# Altium schematic sheet Thermostat_8CH.SchDoc: Thermostat 8CH v1.1
size 420 x 297 mm; Author: G.Kasprowicz; CompanyName: WUT ISE; DrawnBy: G.Kasprowicz; Organization: WUT ISE; Address1: PW ISE; Address2: Nowowiejska 15/19 00-665 Warsaw; Address3: gkasprow@gmail.com; DocumentNumber: 1; Revision: 2; SheetNumber: 1; SheetTotal: 9; ModifiedBy: -; CheckedDate: -; Title2: TOP; DivGrp: WUT ISE; Designer: G.Kasprowicz; ModifiedDate: -; ProjectName: Sensor Box
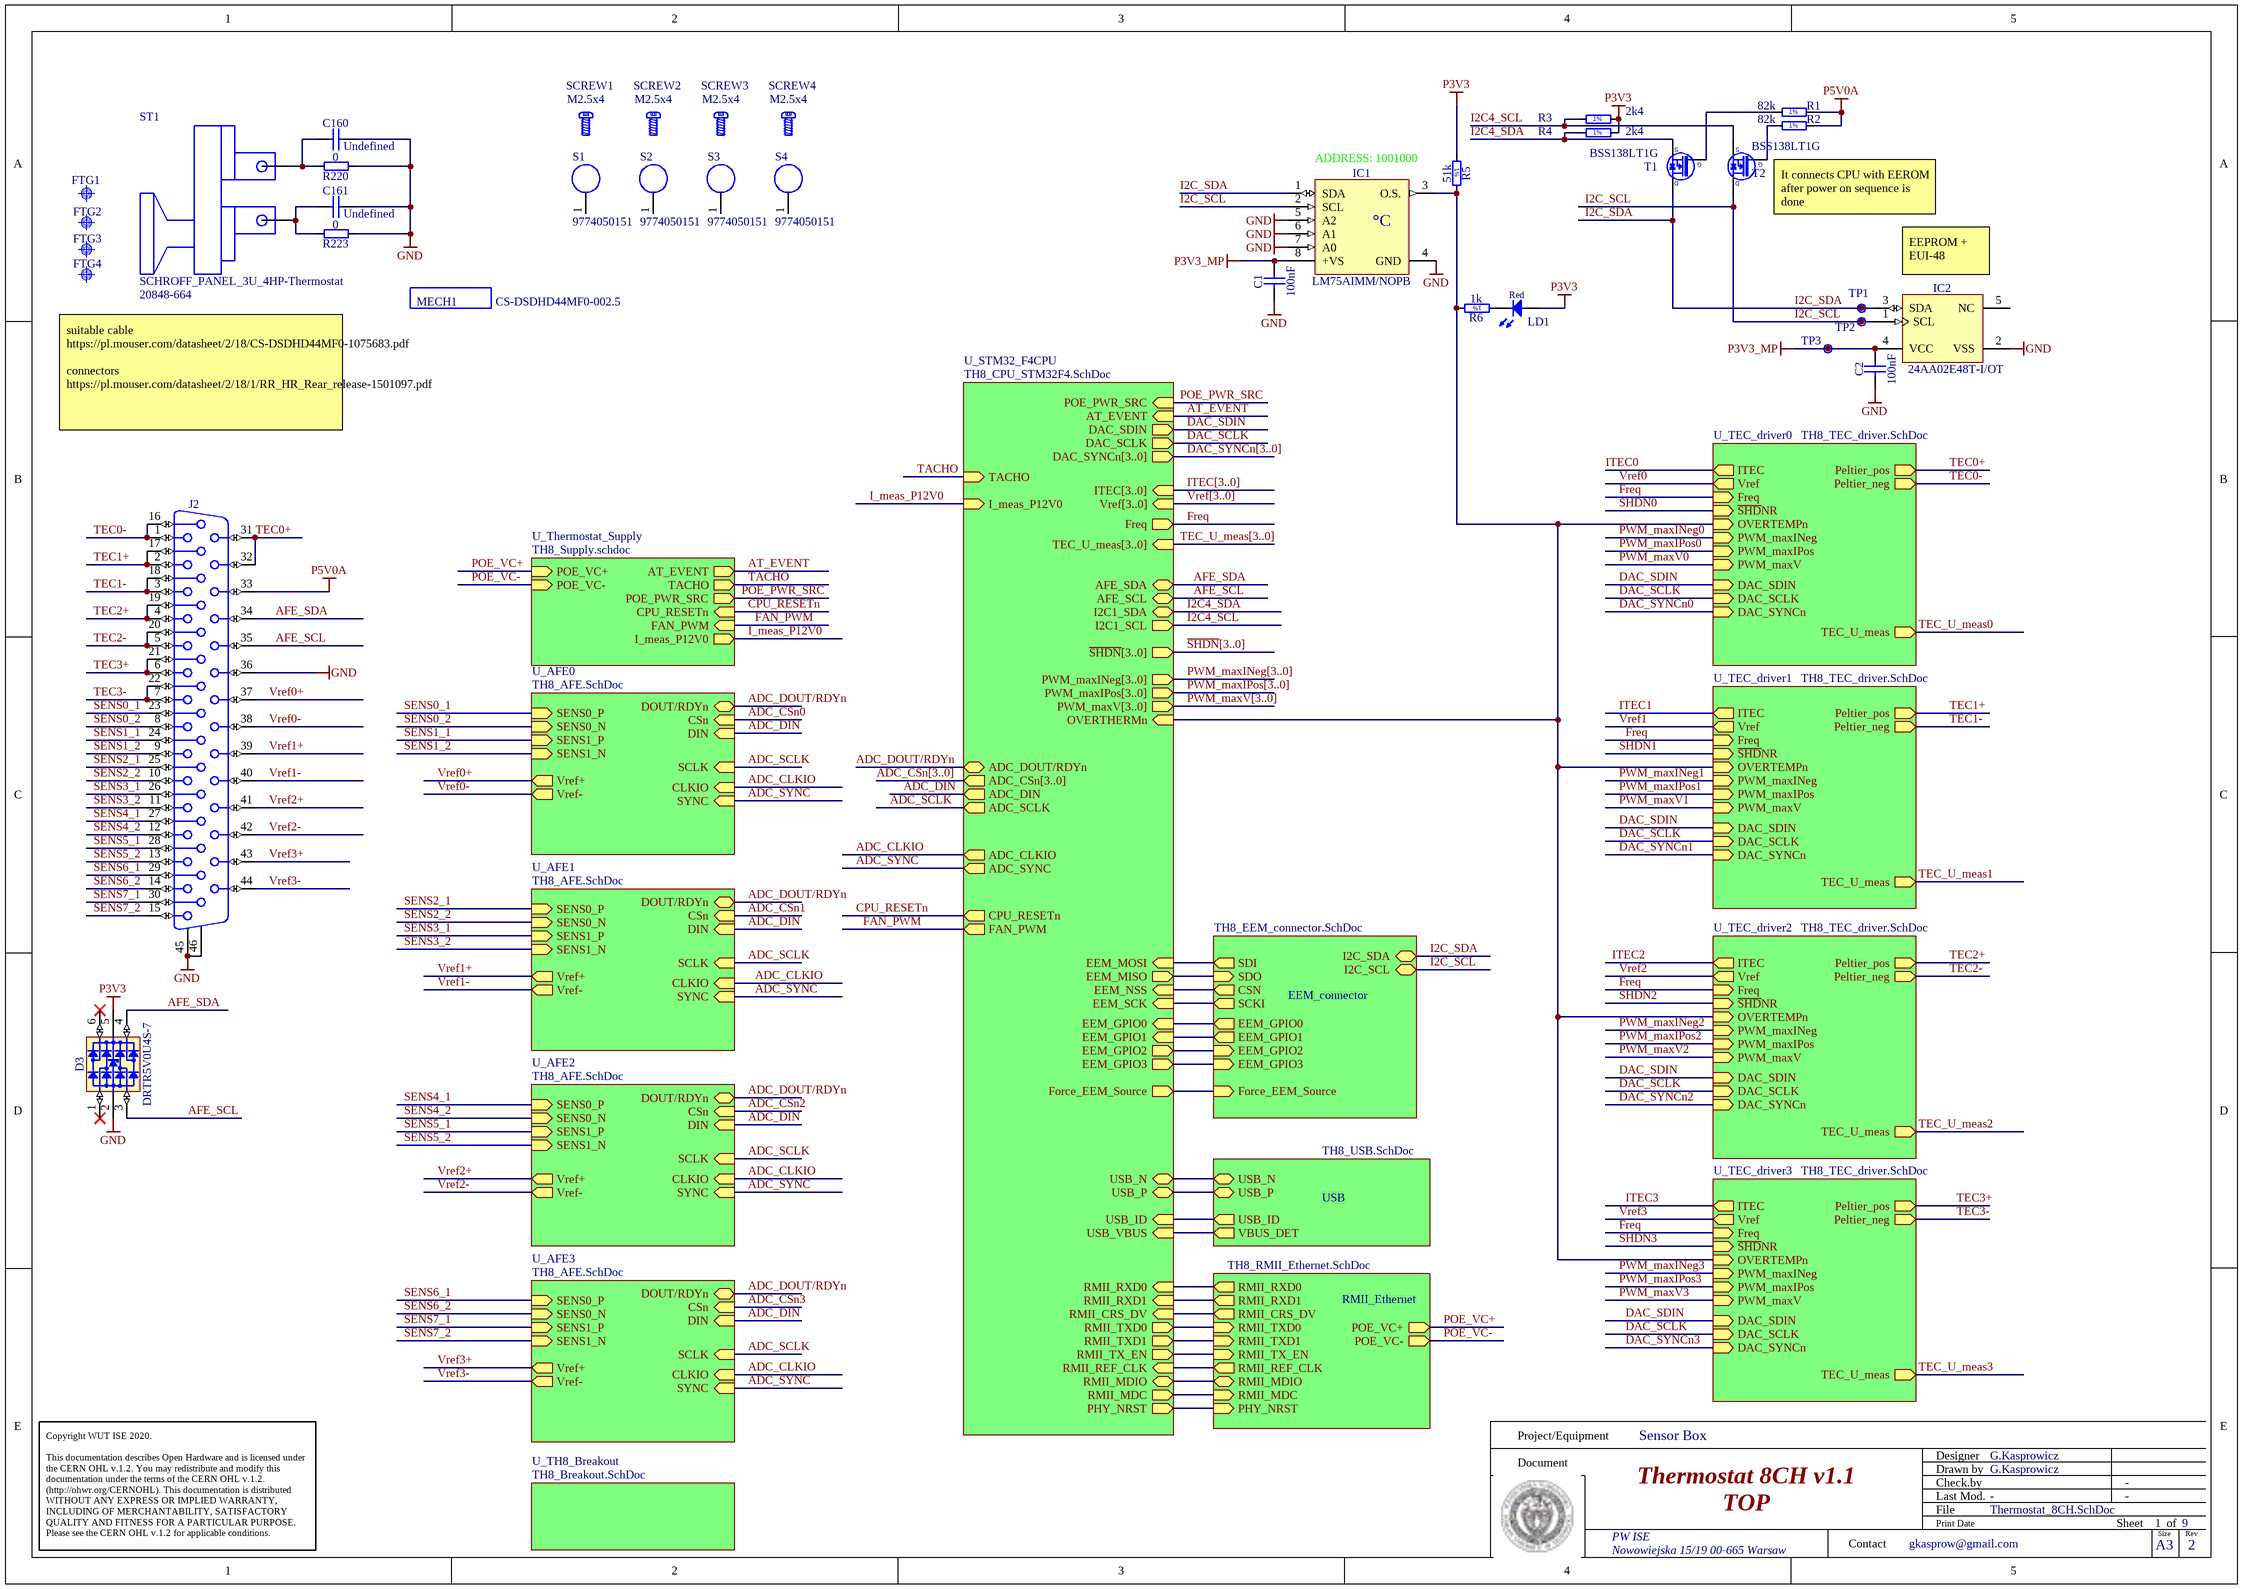
[diagram p0: Thermostat_8CH.SchDoc]

## Parts
C1  100nF  [CAPC1005X55N]
C2  100nF  [CAPC1005X55N]
C160  Undefined  [CAPC2012X135N]
C161  Undefined  [CAPC2012X135N]
D3  DRTR5V0U4S-7  [SOT65P210X110-6N]
FTG1  Use only in PCB  [FIDUCIAL_TOP_S100-200]  (value not drawn)  (no BOM)
FTG2  Use only in PCB  [FIDUCIAL_TOP_S100-200]  (value not drawn)  (no BOM)
FTG3  Use only in PCB  [FIDUCIAL_TOP_S100-200]  (value not drawn)  (no BOM)
FTG4  Use only in PCB  [FIDUCIAL_TOP_S100-200]  (value not drawn)  (no BOM)
IC1  LM75AIMM/NOPB  [SOP65P490X109-8N]
IC2  24AA02E48T-I/OT  [SOT95P280X145-5N]
J2  D-Sub  [AMPHENOL_ICD44S13E6GX00LF]  (value not drawn)
LD1  Red  [LED_KINGBRIGHT_KPH-1608SURCK]
MECH1  CS-DSDHD44MF0-002.5  (mechanical)
R1  82k  [RESC1608X55N]
R2  82k  [RESC1608X55N]
R3  2k4  [RESC1005X40N]
R4  2k4  [RESC1005X40N]
R5  51k  [RESC1005X40N]
R6  1k  [RESC1005X40N]
R220  0  [RESC1608X55N]
R223  0  [RESC1608X55N]
S1  9774050151  [9774050151]
S2  9774050151  [9774050151]
S3  9774050151  [9774050151]
S4  9774050151  [9774050151]
SCREW1  M2.5x4  [BOSSARD_BN5687-3061587_v]
SCREW2  M2.5x4  [BOSSARD_BN5687-3061587_v]
SCREW3  M2.5x4  [BOSSARD_BN5687-3061587_v]
SCREW4  M2.5x4  [BOSSARD_BN5687-3061587_v]
ST1  SCHROFF_PANEL_3U_4HP-Thermostat  Manufacturer Part Number 2: 20848-664  [SCHROFF_PANEL_3HP_4U - Thermostat]
T1  BSS138LT1G  [SOT95P240X110-3N]
T2  BSS138LT1G  [SOT95P240X110-3N]
TP1  Test Point  [TPS127]  (value not drawn)
TP2  Test Point  [TPS127]  (value not drawn)
TP3  Test Point  [TPS127]  (value not drawn)

## Sub-sheets
EEM_connector = TH8_EEM_connector.SchDoc: I2C_SDA (bidir), I2C_SCL (bidir), EEM_GPIO0 (out), EEM_GPIO1 (out), EEM_GPIO2 (in), EEM_GPIO3 (in), SCKI (out), SDI (out), CSN (out), SDO (in), Force_EEM_Source (in)
RMII_Ethernet = TH8_RMII_Ethernet.SchDoc: RMII_TXD0 (in), RMII_TX_EN (in), RMII_RXD0 (out), RMII_REF_CLK (out), RMII_CRS_DV (out), RMII_MDC (in), RMII_MDIO (bidir), PHY_NRST (in), RMII_TXD1 (in), RMII_RXD1 (out), POE_VC+ (out), POE_VC- (out)
U_AFE0 = TH8_AFE.SchDoc: SCLK (in), DOUT/RDYn (bidir), SENS1_P (in), SENS1_N (in), SENS0_N (in), SENS0_P (in), CSn (in), DIN (in), CLKIO (in), SYNC (in), Vref- (out), Vref+ (out)
U_AFE1 = TH8_AFE.SchDoc: SCLK (in), DOUT/RDYn (bidir), SENS1_P (in), SENS1_N (in), SENS0_N (in), SENS0_P (in), CSn (in), DIN (in), CLKIO (in), SYNC (in), Vref- (out), Vref+ (out)
U_AFE2 = TH8_AFE.SchDoc: SCLK (in), DOUT/RDYn (bidir), SENS1_P (in), SENS1_N (in), SENS0_N (in), SENS0_P (in), CSn (in), DIN (in), CLKIO (in), SYNC (in), Vref- (out), Vref+ (out)
U_AFE3 = TH8_AFE.SchDoc: SCLK (in), DOUT/RDYn (bidir), SENS1_P (in), SENS1_N (in), SENS0_N (in), SENS0_P (in), CSn (in), DIN (in), CLKIO (in), SYNC (in), Vref- (out), Vref+ (out)
U_STM32_F4CPU = TH8_CPU_STM32F4.SchDoc: OVERTHERMn (in), ITEC[3..0] (in), Vref[3..0] (in), Freq (out), ~{SHDN}[3..0] (out), PWM_maxINeg[3..0] (out), PWM_maxIPos[3..0] (out), PWM_maxV[3..0] (out), ADC_SCLK (out), ADC_DOUT/RDYn (bidir), ADC_CSn[3..0] (out), ADC_DIN (out), DAC_SDIN (out), DAC_SCLK (out), DAC_SYNCn[3..0] (out), AT_EVENT (in), ADC_CLKIO (out), ADC_SYNC (out), TEC_U_meas[3..0] (in), CPU_RESETn (out), I2C1_SDA (bidir), I2C1_SCL (out), TACHO (in), POE_PWR_SRC (in), RMII_RXD0 (in), RMII_TXD0 (out), RMII_RXD1 (in), RMII_MDC (out), RMII_TXD1 (out), RMII_TX_EN (out), RMII_CRS_DV (in), RMII_REF_CLK (in), RMII_MDIO (bidir), PHY_NRST (out), USB_ID (in), USB_N (bidir), USB_P (bidir), USB_VBUS (in), EEM_MOSI (in), EEM_MISO (out), EEM_NSS (in), EEM_SCK (in), EEM_GPIO0 (in), EEM_GPIO1 (in), EEM_GPIO2 (out), EEM_GPIO3 (out), Force_EEM_Source (out), AFE_SDA (bidir), AFE_SCL (bidir), FAN_PWM (out), I_meas_P12V0 (in)
U_TEC_driver0 = TH8_TEC_driver.SchDoc: Peltier_pos (out), Peltier_neg (out), Freq (in), ~{SHD}NR (in), ITEC (out), Vref (out), PWM_maxINeg (in), PWM_maxIPos (in), PWM_maxV (in), DAC_SDIN (in), DAC_SYNCn (in), DAC_SCLK (in), TEC_U_meas (out), OVERTEMPn (in)
U_TEC_driver1 = TH8_TEC_driver.SchDoc: Peltier_pos (out), Peltier_neg (out), Freq (in), ~{SHD}NR (in), ITEC (out), Vref (out), PWM_maxINeg (in), PWM_maxIPos (in), PWM_maxV (in), DAC_SDIN (in), DAC_SYNCn (in), DAC_SCLK (in), TEC_U_meas (out), OVERTEMPn (in)
U_TEC_driver2 = TH8_TEC_driver.SchDoc: Peltier_pos (out), Peltier_neg (out), Freq (in), ~{SHD}NR (in), ITEC (out), Vref (out), PWM_maxINeg (in), PWM_maxIPos (in), PWM_maxV (in), DAC_SDIN (in), DAC_SYNCn (in), DAC_SCLK (in), TEC_U_meas (out), OVERTEMPn (in)
U_TEC_driver3 = TH8_TEC_driver.SchDoc: Peltier_pos (out), Peltier_neg (out), Freq (in), ~{SHD}NR (in), ITEC (out), Vref (out), PWM_maxINeg (in), PWM_maxIPos (in), PWM_maxV (in), DAC_SDIN (in), DAC_SYNCn (in), DAC_SCLK (in), TEC_U_meas (out), OVERTEMPn (in)
U_TH8_Breakout = TH8_Breakout.SchDoc: no entries
U_Thermostat_Supply = TH8_Supply.schdoc: POE_VC+ (in), POE_VC- (in), AT_EVENT (out), CPU_RESETn (in), TACHO (out), POE_PWR_SRC (out), FAN_PWM (in), I_meas_P12V0 (out)
USB = TH8_USB.SchDoc: VBUS_DET (out), USB_N (bidir), USB_P (bidir), USB_ID (out)

## Nets
GND: C1.1 C2.1 C160.2 C161.2 D3.2(GND) IC1.4(GND) IC1.5(A2) IC1.6(A1) IC1.7(A0) IC2.2(VSS) J2.36 J2.45 J2.46 R220.1 R223.1
P3V3: D3.5(VBUS) LD1.2(A) R3.2 R4.2 R5.1
P3V3_MP: C1.2 C2.2 IC1.8(+VS) IC2.4(VCC) TP3.1
P5V0A: J2.33 R1.2 R2.2
~{SHDN}0: sheet U_TEC_driver0/~{SHD}NR
~{SHDN}1: sheet U_TEC_driver1/~{SHD}NR
~{SHDN}2: sheet U_TEC_driver2/~{SHD}NR
~{SHDN}3: sheet U_TEC_driver3/~{SHD}NR
ADC_CLKIO: sheet U_STM32_F4CPU/ADC_CLKIO, sheet U_AFE0/CLKIO, sheet U_AFE1/CLKIO, sheet U_AFE2/CLKIO, sheet U_AFE3/CLKIO
ADC_CSn0: sheet U_AFE0/CSn
ADC_CSn1: sheet U_AFE1/CSn
ADC_CSn2: sheet U_AFE2/CSn
ADC_CSn3: sheet U_AFE3/CSn
ADC_DIN: sheet U_STM32_F4CPU/ADC_DIN, sheet U_AFE0/DIN, sheet U_AFE1/DIN, sheet U_AFE2/DIN, sheet U_AFE3/DIN
ADC_DOUT/RDYn: sheet U_STM32_F4CPU/ADC_DOUT/RDYn, sheet U_AFE0/DOUT/RDYn, sheet U_AFE1/DOUT/RDYn, sheet U_AFE2/DOUT/RDYn, sheet U_AFE3/DOUT/RDYn
ADC_SCLK: sheet U_STM32_F4CPU/ADC_SCLK, sheet U_AFE0/SCLK, sheet U_AFE1/SCLK, sheet U_AFE2/SCLK, sheet U_AFE3/SCLK
ADC_SYNC: sheet U_STM32_F4CPU/ADC_SYNC, sheet U_AFE0/SYNC, sheet U_AFE1/SYNC, sheet U_AFE2/SYNC, sheet U_AFE3/SYNC
AFE_SCL: D3.3(I/O2) J2.35 ; sheet U_STM32_F4CPU/AFE_SCL
AFE_SDA: D3.4(I/O3) J2.34 ; sheet U_STM32_F4CPU/AFE_SDA
AT_EVENT: sheet U_STM32_F4CPU/AT_EVENT, sheet U_Thermostat_Supply/AT_EVENT
CPU_RESETn: sheet U_STM32_F4CPU/CPU_RESETn, sheet U_Thermostat_Supply/CPU_RESETn
DAC_SCLK: sheet U_STM32_F4CPU/DAC_SCLK, sheet U_TEC_driver0/DAC_SCLK, sheet U_TEC_driver1/DAC_SCLK, sheet U_TEC_driver2/DAC_SCLK, sheet U_TEC_driver3/DAC_SCLK
DAC_SDIN: sheet U_STM32_F4CPU/DAC_SDIN, sheet U_TEC_driver0/DAC_SDIN, sheet U_TEC_driver1/DAC_SDIN, sheet U_TEC_driver2/DAC_SDIN, sheet U_TEC_driver3/DAC_SDIN
DAC_SYNCn0: sheet U_TEC_driver0/DAC_SYNCn
DAC_SYNCn1: sheet U_TEC_driver1/DAC_SYNCn
DAC_SYNCn2: sheet U_TEC_driver2/DAC_SYNCn
DAC_SYNCn3: sheet U_TEC_driver3/DAC_SYNCn
FAN_PWM: sheet U_STM32_F4CPU/FAN_PWM, sheet U_Thermostat_Supply/FAN_PWM
Freq: sheet U_STM32_F4CPU/Freq, sheet U_TEC_driver0/Freq, sheet U_TEC_driver1/Freq, sheet U_TEC_driver2/Freq, sheet U_TEC_driver3/Freq
I2C4_SCL: R3.1 T2.2(S) ; sheet U_STM32_F4CPU/I2C1_SCL
I2C4_SDA: R4.1 T1.2(S) ; sheet U_STM32_F4CPU/I2C1_SDA
I2C_SCL: IC1.2(SCL) IC2.1(SCL) T2.3(D) TP2.1 ; sheet EEM_connector/I2C_SCL
I2C_SDA: IC1.1(SDA) IC2.3(SDA) T1.3(D) TP1.1 ; sheet EEM_connector/I2C_SDA
I_meas_P12V0: sheet U_STM32_F4CPU/I_meas_P12V0, sheet U_Thermostat_Supply/I_meas_P12V0
ITEC0: sheet U_TEC_driver0/ITEC
ITEC1: sheet U_TEC_driver1/ITEC
ITEC2: sheet U_TEC_driver2/ITEC
ITEC3: sheet U_TEC_driver3/ITEC
POE_PWR_SRC: sheet U_STM32_F4CPU/POE_PWR_SRC, sheet U_Thermostat_Supply/POE_PWR_SRC
POE_VC+: sheet RMII_Ethernet/POE_VC+, sheet U_Thermostat_Supply/POE_VC+
POE_VC-: sheet RMII_Ethernet/POE_VC-, sheet U_Thermostat_Supply/POE_VC-
PWM_maxINeg0: sheet U_TEC_driver0/PWM_maxINeg
PWM_maxINeg1: sheet U_TEC_driver1/PWM_maxINeg
PWM_maxINeg2: sheet U_TEC_driver2/PWM_maxINeg
PWM_maxINeg3: sheet U_TEC_driver3/PWM_maxINeg
PWM_maxIPos0: sheet U_TEC_driver0/PWM_maxIPos
PWM_maxIPos1: sheet U_TEC_driver1/PWM_maxIPos
PWM_maxIPos2: sheet U_TEC_driver2/PWM_maxIPos
PWM_maxIPos3: sheet U_TEC_driver3/PWM_maxIPos
PWM_maxV0: sheet U_TEC_driver0/PWM_maxV
PWM_maxV1: sheet U_TEC_driver1/PWM_maxV
PWM_maxV2: sheet U_TEC_driver2/PWM_maxV
PWM_maxV3: sheet U_TEC_driver3/PWM_maxV
SENS0_1: J2.23 ; sheet U_AFE0/SENS0_P
SENS0_2: J2.8 ; sheet U_AFE0/SENS0_N
SENS1_1: J2.24 ; sheet U_AFE0/SENS1_P
SENS1_2: J2.9 ; sheet U_AFE0/SENS1_N
SENS2_1: J2.25 ; sheet U_AFE1/SENS0_P
SENS2_2: J2.10 ; sheet U_AFE1/SENS0_N
SENS3_1: J2.26 ; sheet U_AFE1/SENS1_P
SENS3_2: J2.11 ; sheet U_AFE1/SENS1_N
SENS4_1: J2.27 ; sheet U_AFE2/SENS0_P
SENS4_2: J2.12 ; sheet U_AFE2/SENS0_N
SENS5_1: J2.28 ; sheet U_AFE2/SENS1_P
SENS5_2: J2.13 ; sheet U_AFE2/SENS1_N
SENS6_1: J2.29 ; sheet U_AFE3/SENS0_P
SENS6_2: J2.14 ; sheet U_AFE3/SENS0_N
SENS7_1: J2.30 ; sheet U_AFE3/SENS1_P
SENS7_2: J2.15 ; sheet U_AFE3/SENS1_N
TACHO: sheet U_STM32_F4CPU/TACHO, sheet U_Thermostat_Supply/TACHO
TEC0+: J2.31 J2.32 ; sheet U_TEC_driver0/Peltier_pos
TEC0-: J2.1 J2.16 ; sheet U_TEC_driver0/Peltier_neg
TEC1+: J2.2 J2.17 ; sheet U_TEC_driver1/Peltier_pos
TEC1-: J2.3 J2.18 ; sheet U_TEC_driver1/Peltier_neg
TEC2+: J2.4 J2.19 ; sheet U_TEC_driver2/Peltier_pos
TEC2-: J2.5 J2.20 ; sheet U_TEC_driver2/Peltier_neg
TEC3+: J2.6 J2.21 ; sheet U_TEC_driver3/Peltier_pos
TEC3-: J2.7 J2.22 ; sheet U_TEC_driver3/Peltier_neg
TEC_U_meas0: sheet U_TEC_driver0/TEC_U_meas
TEC_U_meas1: sheet U_TEC_driver1/TEC_U_meas
TEC_U_meas2: sheet U_TEC_driver2/TEC_U_meas
TEC_U_meas3: sheet U_TEC_driver3/TEC_U_meas
Vref0: sheet U_TEC_driver0/Vref
Vref0+: J2.37 ; sheet U_AFE0/Vref+
Vref0-: J2.38 ; sheet U_AFE0/Vref-
Vref1: sheet U_TEC_driver1/Vref
Vref1+: J2.39 ; sheet U_AFE1/Vref+
Vref1-: J2.40 ; sheet U_AFE1/Vref-
Vref2: sheet U_TEC_driver2/Vref
Vref2+: J2.41 ; sheet U_AFE2/Vref+
Vref2-: J2.42 ; sheet U_AFE2/Vref-
Vref3: sheet U_TEC_driver3/Vref
Vref3+: J2.43 ; sheet U_AFE3/Vref+
Vref3-: J2.44 ; sheet U_AFE3/Vref-
NetC160_1: C160.1 R220.2 ST1.1
NetC161_1: C161.1 R223.2 ST1.0
NetIC1_3: IC1.3(O.S.) R5.2 R6.2 ; sheet U_STM32_F4CPU/OVERTHERMn, sheet U_TEC_driver0/OVERTEMPn, sheet U_TEC_driver1/OVERTEMPn, sheet U_TEC_driver2/OVERTEMPn, sheet U_TEC_driver3/OVERTEMPn
NetLD1_1: LD1.1(C) R6.1
NetR1_1: R1.1 T1.1(G)
NetR2_1: R2.1 T2.1(G)
(unnamed): sheet U_STM32_F4CPU/RMII_RXD0, sheet RMII_Ethernet/RMII_RXD0
(unnamed): sheet U_STM32_F4CPU/RMII_TXD0, sheet RMII_Ethernet/RMII_TXD0
(unnamed): sheet U_STM32_F4CPU/RMII_RXD1, sheet RMII_Ethernet/RMII_RXD1
(unnamed): sheet U_STM32_F4CPU/RMII_MDC, sheet RMII_Ethernet/RMII_MDC
(unnamed): sheet U_STM32_F4CPU/RMII_TXD1, sheet RMII_Ethernet/RMII_TXD1
(unnamed): sheet U_STM32_F4CPU/RMII_TX_EN, sheet RMII_Ethernet/RMII_TX_EN
(unnamed): sheet U_STM32_F4CPU/RMII_CRS_DV, sheet RMII_Ethernet/RMII_CRS_DV
(unnamed): sheet U_STM32_F4CPU/RMII_REF_CLK, sheet RMII_Ethernet/RMII_REF_CLK
(unnamed): sheet U_STM32_F4CPU/RMII_MDIO, sheet RMII_Ethernet/RMII_MDIO
(unnamed): sheet U_STM32_F4CPU/PHY_NRST, sheet RMII_Ethernet/PHY_NRST
(unnamed): sheet U_STM32_F4CPU/USB_ID, sheet USB/USB_ID
(unnamed): sheet U_STM32_F4CPU/USB_N, sheet USB/USB_N
(unnamed): sheet U_STM32_F4CPU/USB_P, sheet USB/USB_P
(unnamed): sheet U_STM32_F4CPU/USB_VBUS, sheet USB/VBUS_DET
(unnamed): sheet U_STM32_F4CPU/EEM_MOSI, sheet EEM_connector/SDI
(unnamed): sheet U_STM32_F4CPU/EEM_MISO, sheet EEM_connector/SDO
(unnamed): sheet U_STM32_F4CPU/EEM_NSS, sheet EEM_connector/CSN
(unnamed): sheet U_STM32_F4CPU/EEM_SCK, sheet EEM_connector/SCKI
(unnamed): sheet U_STM32_F4CPU/EEM_GPIO0, sheet EEM_connector/EEM_GPIO0
(unnamed): sheet U_STM32_F4CPU/EEM_GPIO1, sheet EEM_connector/EEM_GPIO1
(unnamed): sheet U_STM32_F4CPU/EEM_GPIO2, sheet EEM_connector/EEM_GPIO2
(unnamed): sheet U_STM32_F4CPU/EEM_GPIO3, sheet EEM_connector/EEM_GPIO3
(unnamed): sheet U_STM32_F4CPU/Force_EEM_Source, sheet EEM_connector/Force_EEM_Source

Not connected (* = marked no-connect by the designer): D3 1(I/O1)* 6(I/O4)*; IC2 5(NC); S1 1; S2 1; S3 1; S4 1

## Buses and harness runs
bus ADC_CSn[3..0] = sheet U_STM32_F4CPU/ADC_CSn[3..0]
bus DAC_SYNCn[3..0] = sheet U_STM32_F4CPU/DAC_SYNCn[3..0]
bus ITEC[3..0] = sheet U_STM32_F4CPU/ITEC[3..0]
bus PWM_maxINeg[3..0] = sheet U_STM32_F4CPU/PWM_maxINeg[3..0]
bus PWM_maxIPos[3..0] = sheet U_STM32_F4CPU/PWM_maxIPos[3..0]
bus PWM_maxV[3..0] = sheet U_STM32_F4CPU/PWM_maxV[3..0]
bus TEC_U_meas[3..0] = sheet U_STM32_F4CPU/TEC_U_meas[3..0]
bus Vref[3..0] = sheet U_STM32_F4CPU/Vref[3..0]
bus ~{SHDN}[3..0] = sheet U_STM32_F4CPU/~{SHDN}[3..0]

## Notes on the sheet
- ADDRESS: 1001000
- It connects CPU with EEROM after power on sequence is done
- EEPROM + EUI-48
- (near FTG4) suitable cable https://pl.mouser.com/datasheet/2/18/CS-DSDHD44MF0-1075683.pdf
  connectors
  https://pl.mouser.com/datasheet/2/18/1/RR_HR_Rear_release-1501097.pdf
- Project/Equipment
- Document
- Designer
- Drawn by
- Check.by
- Copyright WUT ISE 2020.
  This documentation describes Open Hardware and is licensed under the CERN OHL v.1.2. You may redistribute and modify this documentation under the terms of the CERN OHL v.1.2. (http://ohwr.org/CERNOHL). This documentation is distributed WITHOUT ANY EXPRESS OR IMPLIED WARRANTY, INCLUDING OF MERCHANTABILITY, SATISFACTORY QUALITY AND FITNESS FOR A PARTICULAR PURPOSE. Please see the CERN OHL v.1.2 for applicable conditions.
- Contact
- File
- Last Mod.
- Print Date
- Sheet
- Size
- A3
- of
- Rev
- (in symbol LM75AIMM/NOPB) °C
- (in symbol R0402_1K_1%_0.0625W_100PPM) 1%
- (in symbol R0402_2K4_1%_0.0625W_100PPM) 1%
- (in symbol R0402_51K_1%_0.0625W_100PPM) 1%
- (in symbol R0603_82K_1%_0.1W_100PPM) 1%

## Library data of the parts
C1 C2 = CC0402_100NF_16V_10%_X5R: Non-polarised capacitor; Part Description: SMD Multilayer Chip Ceramic Capacitor; Manufacturer: GENERIC; Manufacturer1 Part Number: GRM155R61C104KA88D; Voltage: 16V; TC: X5R; Tolerance: ±10%; Part Number: CC0402_100NF_16V_10%_X5R; Component Kind: Standard; Component Type: Standard; Pin Count: 2; Value: 100nF; Status: None; Manufacturer Part Number: CC0402_100NF_16V_10%_X5R; Case: 0402; Mounted: Yes; Socket: No; SMD: Yes; Sense: No; Manufacturer1 Example: MURATA; Manufacturer1 ComponentHeight: 0.55mm; HelpURL: \\cern.ch\dfs\Applications\Altium\Datasheets\CC0402_X5R_MURATA_GRM.pdf; Author: CERN DEM JLC; CreateDate: 10.12.2013; LatestRevisionDate: 10.12.2013
C160 C161 = CC0805_NO-VALUE: Non-polarised capacitor; Part Description: Reserved Footprint For 0805(2012) Chip Ceramic Capacitor; Mounted: No; Part Number: CC0805_NO-VALUE; Component Kind: Standard; Component Type: Standard; Pin Count: 2; Value: Undefined; Status: None; Manufacturer: Undefined; Manufacturer Part Number: CC0805_NO-VALUE; Case: 0805; Socket: No; SMD: Yes; Sense: No; Manufacturer1 ComponentHeight: 1.35mm; HelpURL: Undefined; Author: CERN DEM JLC; CreateDate: 10.12.2008; LatestRevisionDate: 11.09.2013
D3 = D_TVS_DRTR5V0U4S-7: Integrated Quad Ultra-Low Capacitance ESD Protection; Part Description: Integrated Quad Ultra-Low Capacitance ESD (±8kV) Protection; Manufacturer: DIODES; PressFit: No; Bonding: No; Status Comment: Active; Part Number: DRTR5V0U4S-7; Component Kind: Standard; Component Type: Standard; Device: DRTR5V0U4S-7; PackageDescription: SOT363, SC70-6, 0.65mm Pitch; 6 Pin, 1.25mm W X 2.00mm L X 1.10mm H body, IPC Medium Density; Status: Active; Manufacturer Part Number: DRTR5V0U4S-7; Pin Count: 6; Case: SOT363; Mounted: Yes; Socket: No; SMD: Yes; Sense: No; ComponentHeight: 1.1mm; HelpURL: \\cern.ch\dfs\Applications\Altium\Datasheets\PRTR5V0U4Y.pdf; Author: GK; CreateDate: 24.01.2017; LatestRevisionDate: 14.09.2020
FTG1-FTG4 = FIDUCIAL_TARGET_S100-200: Fiducial Target; Part Description: Square Fiducial Target, Top Layer, 1.0mm, Top Solder 2.0mm, Keepout =2.0mm; Mounted: No; Part Number: FIDUCIAL_TARGET_S100-200; Component Type: Standard (No BOM); Pin Count: 1; Family: Fiducial; Socket: No; SMD: Yes; Sense: No; Status: None; ComponentHeight: 0mm; HelpURL: Undefined; Author: CERN DEM JLC; CreateDate: 09.02.2010; LatestRevisionDate: 04.04.2012; PackageDescription: Square Fiducial Target, Top Layer, 1.0mm, Top Solder 2.0mm, Keepout =2.0mm
IC1 = LM75AIMM/NOPB: Digital Temperature Sensor and Thermal Watchdog with Two-Wire Interface; Part Description: -25° to +100°C ±2°C Digital Temperature Sensor and Thermal Watchdog with Two-Wire Interface; Manufacturer: TEXAS INSTRUMENTS; PressFit: No; Bonding: No; Part Number: LM75AIMM/NOPB; Component Kind: Standard; Component Type: Standard; Device: LM75AIMM/NOPB; PackageDescription: SOP, 0.65mm pitch; 8 pin,3.00mm W X 3.00mm L X 1.09mm H bodyI, PC Medium Density; Manufacturer Part Number: LM75AIMM/NOPB; Pin Count: 8; Case: SSOP8; Mounted: Yes; Socket: No; SMD: Yes; Sense: No; ComponentHeight: 1.09mm; HelpURL: \\cern.ch\dfs\Applications\Altium\Datasheets\LM75AIMM-NOPB.pdf; Author: CERN DEM JLC; CreateDate: 15.10.2012; LatestRevisionDate: 15.10.2012
IC2 = 24AA02E48T-I/OT: 1.7V-5.5V, 2K I2C Serial EEPROM With EUI-48 Node Identity; Manufacturer: MICROCHIP TECHNOLOGY; PressFit: No; Bonding: No; Part Number: 24AA02E48T-I/OT; Component Kind: Standard; Component Type: Standard; Device: 24AA02E48T-I/OT; PackageDescription: SOT, 0.95mm pitch; 5 pin, 1.60mm W X 2.90mm L X 1.45mm H body, IPC Medium Density; Part Description: 1.7V-5.5V, 2K I2C Serial EEPROM With EUI-48 Node Identity; Manufacturer Part Number: 24AA02E48T-I/OT; Pin Count: 5; Case: SOT23-5; Mounted: Yes; Socket: No; SMD: Yes; Sense: No; ComponentHeight: 1.45mm; HelpURL: \\cern.ch\dfs\Applications\Altium\Datasheets\24AA02E48T-I-OT.pdf; Author: CERN DEM MR; CreateDate: 31.03.2016; LatestRevisionDate: 31.03.2016
J2 = AMPHENOL_ICD44S13E6GX00LF: Connector D-sub 44 Female; Part Description: Right Angle High Density D-sub 44 Female Contacts with Harpoons + Insert UNC 4-40 + Electrical Continuity; PressFit: No; Part Number: AMPHENOL_ICD44S13E6GX00LF; Component Kind: Standard; Component Type: Standard; Pin Count: 46; Family: D-Sub; Mounted: Yes; Socket: No; SMD: No; Sense: No; Status: None; Manufacturer: AMPHENOL; Manufacturer Part Number: ICD44S13E6GX00LF; ComponentHeight: 12.96mm; HelpURL: \\cern.ch\dfs\Applications\Altium\Datasheets\AMPHENOL_ICD44S13E6GX00LF.pdf; Author: CERN DEM BC; CreateDate: 22.10.2020; LatestRevisionDate: 22.10.2020
LD1 = LED_KINGBRIGHT_KPH-1608SURCK: LED Red 1C 2A; Part Description: SMD Hyper Red LED, Case 1.6mmX0.8mm(0603), 0.65mm Thickness; PressFit: No; Bonding: No; Part Number: LED_KINGBRIGHT_KPH-1608SURCK; Component Kind: Standard; Component Type: Standard; Color: Red; PackageDescription: SMT Hyper Red LED, Case 0603, Body L 1.6 x W 0.8mm H 0.65mm; Manufacturer: KINGBRIGHT; Manufacturer Part Number: KPH-1608SURCK; Pin Count: 2; Mounted: Yes; Socket: No; SMD: Yes; Sense: No; ComponentHeight: 0.65mm; HelpURL: \\cern.ch\dfs\Applications\Altium\Datasheets\LED_KINGBRIGHT_KPH-1608SURCK.pdf; Author: CERN DEM JLC; CreateDate: 03.07.2017; LatestRevisionDate: 03.07.2017
MECH1 = Generic_mechanical: D-Sub Cables DELUXE HD44 M/F MOLDED 2.5'; Part Description: D-sub44 cable; Manufacturer: Amphenol; PressFit: No; Value: 750mm; Part Number: CS-DSDHD44MF0-002.5; Component Type: Standard; Footprint: generic_MECH; Pin Count: 0; PackageDescription: generic; Mounted: Yes; Socket: No; SMD: No; Sense: No; Status: None; Manufacturer Part Number: CS-DSDHD44MF0-002.5; ComponentHeight: generic; Author: GK; CreateDate: 28.10.2019; LatestRevisionDate: 28.10.2019
R1 R2 = R0603_82K_1%_0.1W_100PPM: Resistor - 1%; Part Description: General Purpose Thick Film Chip Resistor; Manufacturer: GENERIC; Manufacturer1 Part Number: NRC06F8202TRF; Power: 0.1W; TC: ±100ppm/°C; PressFit: No; Part Number: R0603_82K_1%_0.1W_100PPM; Component Kind: Standard; Component Type: Standard; Pin Count: 2; Value: 82k; Status: Preferred; Tolerance: ±1%; Manufacturer Part Number: R0603_82K_1%_0.1W_100PPM; Case: 0603; Mounted: Yes; Sense: No; Socket: No; SMD: Yes; Manufacturer1 Example: NIC COMPONENT; Manufacturer1 ComponentHeight: 0.55mm; HelpURL: \\cern.ch\dfs\Applications\Altium\Datasheets\R0603_NIC_NRC.pdf; Author: CERN DEM JLC; CreateDate: 03.12.2007; LatestRevisionDate: 13.03.2008
R3 R4 = R0402_2K4_1%_0.0625W_100PPM: Resistor - 1%; Part Description: General Purpose Thick Film Chip Resistor; Manufacturer: GENERIC; Manufacturer1 Part Number: 232270672402L; TC: ±100ppm/°C; PressFit: No; Part Number: R0402_2K4_1%_0.0625W_100PPM; Component Kind: Standard; Component Type: Standard; Pin Count: 2; Value: 2k4; Status: Not Recommended; Power: 0.0625W; Tolerance: ±1%; Manufacturer Part Number: R0402_2K4_1%_0.0625W_100PPM; Case: 0402; Mounted: Yes; Sense: No; Socket: No; SMD: Yes; Manufacturer1 Example: YAGEO PHYCOMP; Manufacturer1 ComponentHeight: 0.4mm; HelpURL: \\cern.ch\dfs\Applications\Altium\Datasheets\R0402_Phycomp_RC0402.pdf; Author: CERN DEM JLC; CreateDate: 03.12.2007; LatestRevisionDate: 17.10.2012
R5 = R0402_51K_1%_0.0625W_100PPM: Resistor - 1%; Part Description: General Purpose Thick Film Chip Resistor; Manufacturer: GENERIC; Manufacturer1 Part Number: 232270674703L; TC: ±100ppm/°C; PressFit: No; Part Number: R0402_51K_1%_0.0625W_100PPM; Component Kind: Standard; Component Type: Standard; Pin Count: 2; Value: 51k; Status: Not Recommended; Power: 0.0625W; Tolerance: ±1%; Manufacturer Part Number: R0402_51K_1%_0.0625W_100PPM; Case: 0402; Mounted: Yes; Sense: No; Socket: No; SMD: Yes; Manufacturer1 Example: YAGEO PHYCOMP; Manufacturer1 ComponentHeight: 0.4mm; HelpURL: \\cern.ch\dfs\Applications\Altium\Datasheets\R0402_Phycomp_RC0402.pdf; Author: CERN DEM JLC; CreateDate: 03.12.2007; LatestRevisionDate: 17.10.2012
R6 = R0402_1K_1%_0.0625W_100PPM: Resistor - 1%; Part Description: General Purpose Thick Film Chip Resistor; Manufacturer: GENERIC; Manufacturer1 Part Number: 232270671002L; TC: ±100ppm/°C; PressFit: No; Part Number: R0402_1K_1%_0.0625W_100PPM; Component Kind: Standard; Component Type: Standard; Pin Count: 2; Value: 1k; Status: Not Recommended; Power: 0.0625W; Tolerance: ±1%; Manufacturer Part Number: R0402_1K_1%_0.0625W_100PPM; Case: 0402; Mounted: Yes; Sense: No; Socket: No; SMD: Yes; Manufacturer1 Example: YAGEO PHYCOMP; Manufacturer1 ComponentHeight: 0.4mm; HelpURL: \\cern.ch\dfs\Applications\Altium\Datasheets\R0402_Phycomp_RC0402.pdf; Author: CERN DEM JLC; CreateDate: 03.12.2007; LatestRevisionDate: 17.10.2012
R220 R223 = R0603_0R_JUMPER: Resistor; Part Description: 1A (0.05R Max DC Resistance) Zero Ohm Jumper; Manufacturer: GENERIC; Manufacturer1 Part Number: NRC06Z0; PressFit: No; Part Number: R0603_0R_JUMPER; Component Kind: Standard; Component Type: Standard; Pin Count: 2; Value: 0; Status: Preferred; Manufacturer Part Number: R0603_0R_JUMPER; Case: 0603; Mounted: Yes; Sense: No; Socket: No; SMD: Yes; Manufacturer1 Example: NIC COMPONENT; Manufacturer1 ComponentHeight: 0.55mm; HelpURL: \\cern.ch\dfs\Applications\Altium\Datasheets\R0603_NIC_NRC.pdf; Author: CERN DEM JLC; CreateDate: 03.12.2007; LatestRevisionDate: 13.03.2008
S1-S4 = WA-SMSI,  9774050151: WA-SMSI SMD Steel Spacer with internal Thread; Manufacturer: Wurth Elektronik; partNo: 9774050151; ComponentLink1Description: Manufacturer; ComponentLink1URL: http://www.we-online.de; Created by: Baojun Chen; Created Date: 20.Oct.2015; ComponentLink2Description: Datasheet; ComponentLink2URL: http://katalog.we-online.de/em/datasheet/9774050151.pdf
SCREW1-SCREW4 = BOSSARD_BN5687-3061587_v: Screw; Part Description: M2.5 L=4mm Hexalobular Socket Pan Head Screw, Fully Threaded, Stainless Steel A2; Manufacturer Part Number: BN5687 Art.3061587; PressFit: No; Part Number: BOSSARD_BN5687-3061587_v; Component Kind: Standard; Component Type: Mechanical; Pin Count: 0; PackageDescription: M2.5 L=4mm Hexalobular Socket Pan Head Screw, Fully Threaded - Stainless Steel A2; Mounted: Yes; Socket: No; SMD: No; Sense: No; Status: None; Value: M2.5x4; Manufacturer: BOSSARD; ComponentHeight: 5mm; HelpURL: \\cern.ch\dfs\Applications\Altium\Datasheets\BOSSARD_BN5687-3061587.pdf; Author: CERN DEM JLC; CreateDate: 22.08.2013; LatestRevisionDate: 22.08.2013
ST1 = SCHROFF_PANEL_3U_4HP_Thermostat: Schroff 3HP 4U EUROCARD Panel; Manufacturer Part Number: 20818-017; Manufacturer: Schroff
T1 T2 = BSS138LT1G: N-CHANNEL MOSFET WITH DIODE; Part Description: 50V 200mA N-Channel Enhancement Mode Field-Effect Transistor; Manufacturer: ON SEMICONDUCTOR; PressFit: No; Bonding: No; Part Number: BSS138LT1G; Component Kind: Standard; Component Type: Standard; Device: BSS138LT1G; PackageDescription: SOT23 3-Leads, Pitch 0.95mm - Body 1.4x3mm, IPC Medium Density; Manufacturer Part Number: BSS138LT1G; Pin Count: 3; Case: SOT23-3; Mounted: Yes; Socket: No; SMD: Yes; Sense: No; ComponentHeight: 1.11mm; HelpURL: \\cern.ch\dfs\Applications\Altium\Datasheets\BSS138LT1G.pdf; Author: CERN DEM JLC; CreateDate: 23.03.2009; LatestRevisionDate: 23.03.2009
TP1-TP3 = SMD_PAD_1.27X1.27MM: Part Description: 1.27mm x 1.27mm PCB Copper Area (SMD Test Point); Mounted: No; Part Number: SMD_PAD_1.27X1.27MM; Component Kind: Standard (No BOM); Component Type: Standard (No BOM); Pin Count: 1; Family: Test Point; Socket: No; SMD: Yes; Sense: No; Status: None; ComponentHeight: 0mm; HelpURL: Undefined; Author: CERN DEM JLC; CreateDate: 12.01.2008; LatestRevisionDate: 12.01.2008; PackageDescription: 1.27mm x 1.27mm PCB Copper Area (SMD Test Point)